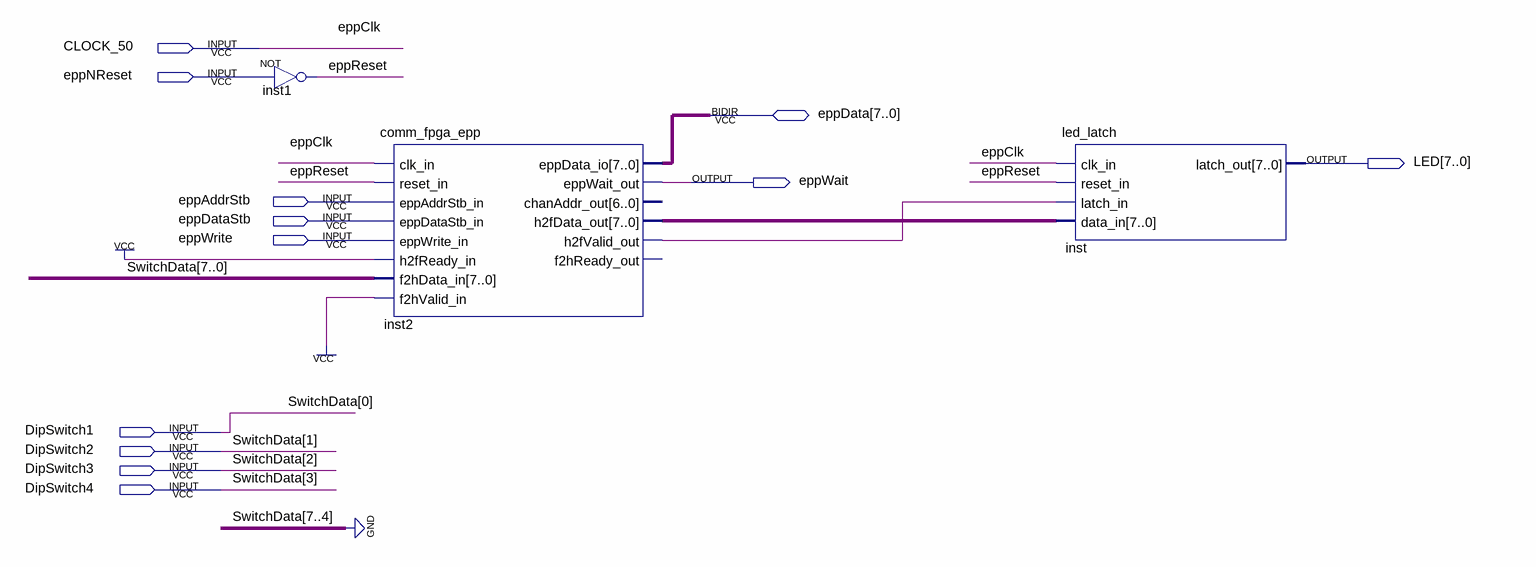
[diagram p0: schematic sheet]
// Quartus schematic Block1.bdf as structural Verilog: 3 symbols, 12 pins
module Block1 (
  input  CLOCK_50,
  input  eppNReset,
  input  eppAddrStb,
  input  eppDataStb,
  input  eppWrite,
  input  DipSwitch1,
  input  DipSwitch2,
  input  DipSwitch3,
  input  DipSwitch4,
  inout  [7:0] eppData,
  output [7:0] LED,
  output eppWait
);

  wire eppReset, inst2_h2fvalid_out;
  wire [7:0] inst2_h2fdata_out;

  not inst1 (eppReset, eppNReset);
  comm_fpga_epp inst2 (
    .clk_in(CLOCK_50), .reset_in(eppReset), .eppAddrStb_in(eppAddrStb), .eppDataStb_in(eppDataStb),
    .eppWrite_in(eppWrite), .h2fReady_in(1'b1),
    .f2hData_in({4'b0000, DipSwitch4, DipSwitch3, DipSwitch2, DipSwitch1}), .f2hValid_in(1'b1),
    .eppWait_out(eppWait), .h2fData_out(inst2_h2fdata_out), .h2fValid_out(inst2_h2fvalid_out),
    .eppData_io(eppData));  // open: chanAddr_out, f2hReady_out
  led_latch inst (
    .clk_in(CLOCK_50), .reset_in(eppReset), .latch_in(inst2_h2fvalid_out), .data_in(inst2_h2fdata_out),
    .latch_out(LED));

  // Other names for the same wires on the sheet: SwitchData[3:0] = {DipSwitch4, DipSwitch3, DipSwitch2, DipSwitch1};
  //   eppClk = CLOCK_50
endmodule
